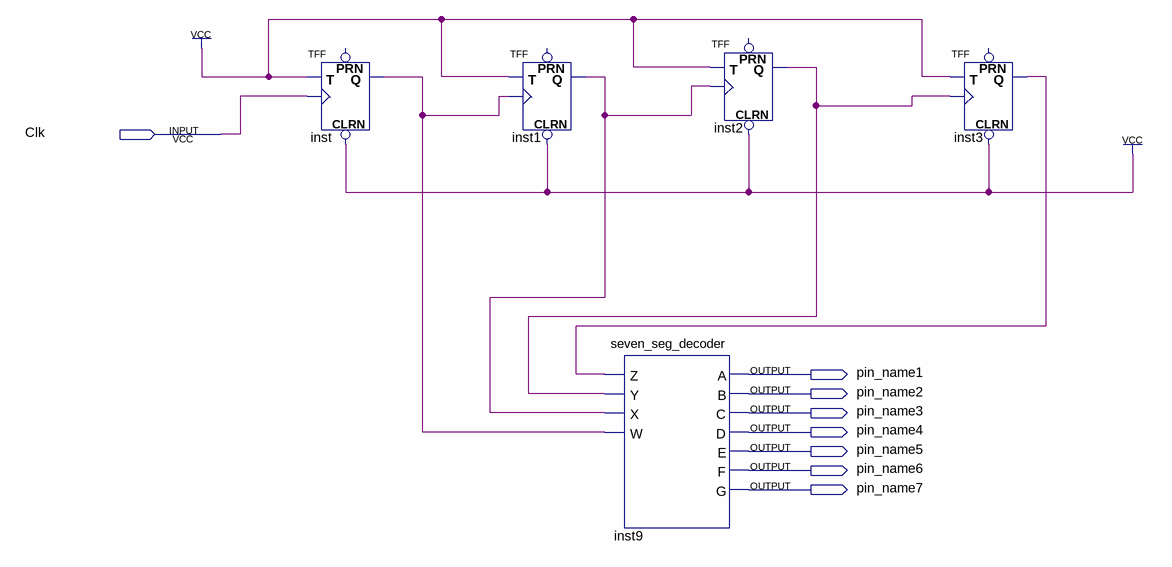
[diagram p0: schematic sheet]
// Quartus schematic lab10step3b.bdf as structural Verilog: 5 symbols, 8 pins
module lab10step3b (
  input  Clk,
  output pin_name1,
  output pin_name2,
  output pin_name3,
  output pin_name4,
  output pin_name5,
  output pin_name6,
  output pin_name7
);

  wire inst1_q, inst2_q, inst3_q, inst_q;

  TFF inst (.CLRN(1'b1), .T(1'b1), .CLK(Clk), .Q(inst_q));  // open: PRN
  TFF inst1 (.CLRN(1'b1), .T(1'b1), .CLK(inst_q), .Q(inst1_q));  // open: PRN
  seven_seg_decoder inst9 (
    .Z(inst3_q), .Y(inst2_q), .X(inst1_q), .W(inst_q), .A(pin_name1), .B(pin_name2), .C(pin_name3),
    .D(pin_name4), .E(pin_name5), .F(pin_name6), .G(pin_name7));
  TFF inst2 (.CLRN(1'b1), .T(1'b1), .CLK(inst1_q), .Q(inst2_q));  // open: PRN
  TFF inst3 (.CLRN(1'b1), .T(1'b1), .CLK(inst2_q), .Q(inst3_q));  // open: PRN
endmodule
